# Altium schematic sheet USB_SD.SchDoc
size Tabloid; DrawnBy: V-P.Rheaume@USherbrooke.ca; Organization: Universite de Sherbrooke; Address1: L3, 12a Rodborough Rd; Address2: Frenchs Forest; Address3: NSW; Address4: Australia 2086; Revision: 0; SheetNumber: 4; SheetTotal: 8; SheetName: USB hub
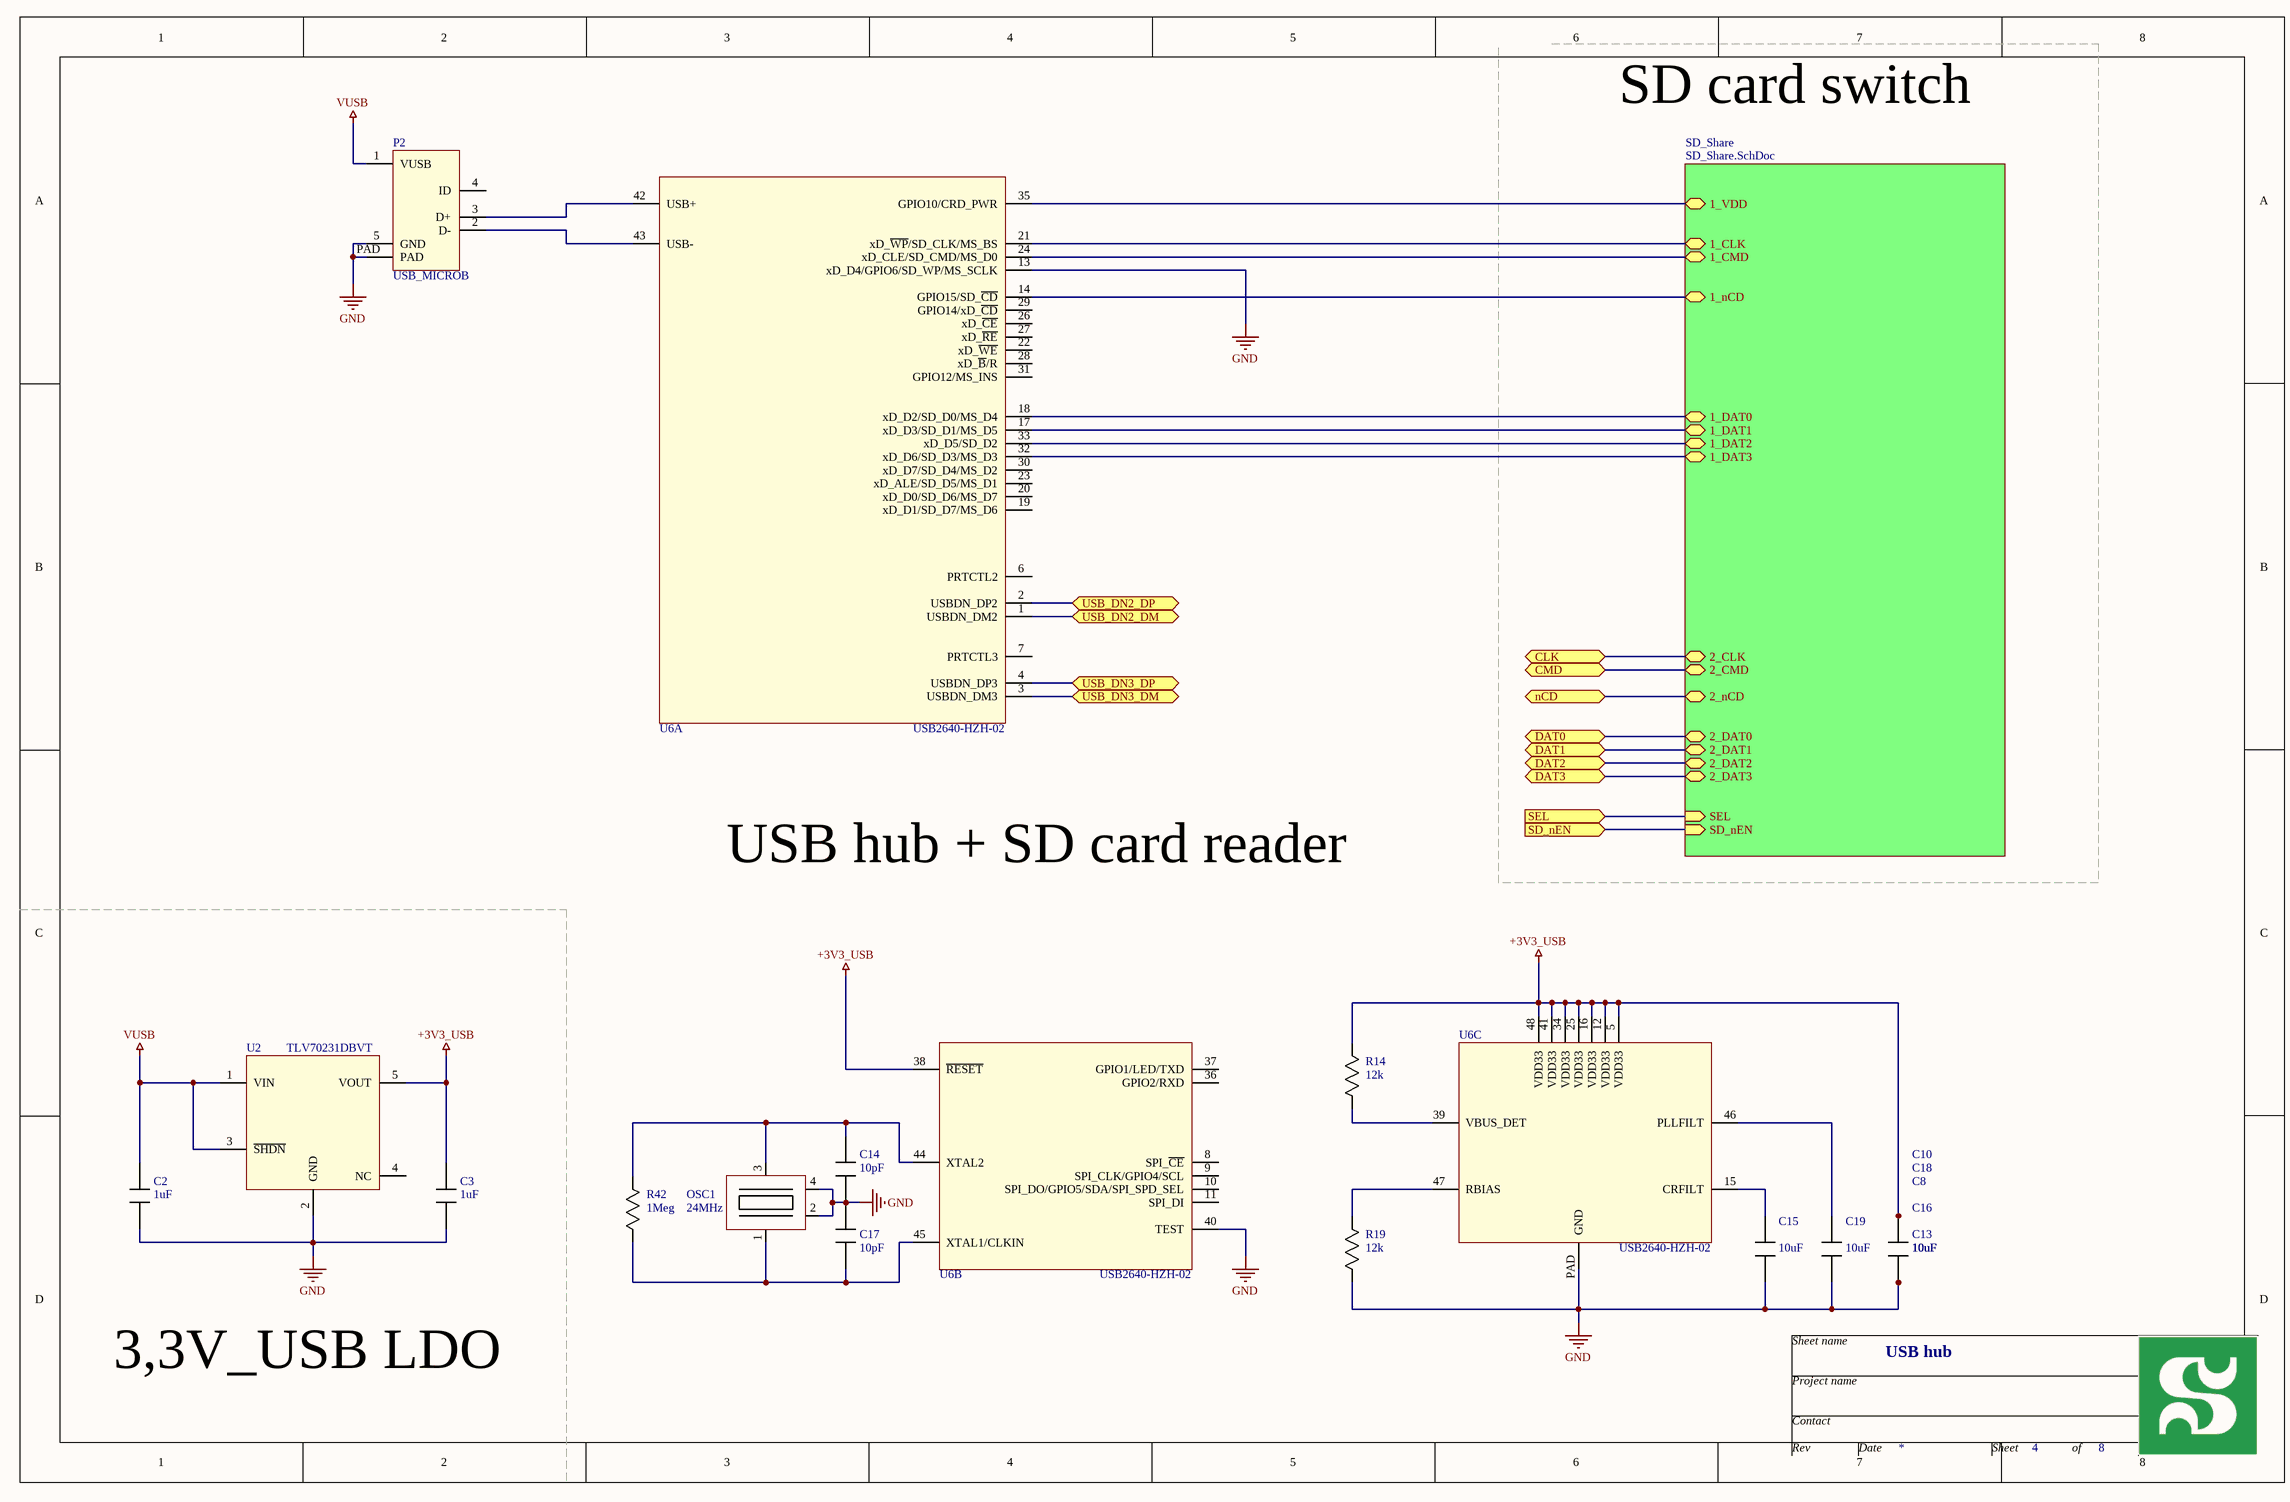
[diagram p0: USB_SD.SchDoc]

## Parts
C2  value 1uF  [0603]  (hidden comment: Capacitor)
C3  value 1uF  [0603]  (hidden comment: Capacitor)
C8  value 10uF  [0603]  (hidden comment: Capacitor)
C10  value 10uF  [0603]  (hidden comment: Capacitor)
C13  value 10uF  [0603]  (hidden comment: Capacitor)
C14  value 10pF  [0402]  (hidden comment: Capacitor)
C15  value 10uF  [0603]  (hidden comment: Capacitor)
C16  value 10uF  [0603]  (hidden comment: Capacitor)
C17  value 10pF  [0402]  (hidden comment: Capacitor)
C18  value 10uF  [0603]  (hidden comment: Capacitor)
C19  value 10uF  [0603]  (hidden comment: Capacitor)
OSC1  value 24MHz  [XTAL_ABM10]  (hidden comment: Crystal_4)
P2  USB_MICROB  [USB_MICROB]
R14  value 12k  [0402]  (hidden comment: Resistor)
R19  value 12k  [0402]  (hidden comment: Resistor)
R42  value 1Meg  [0603]  (hidden comment: Resistor)
U2  Mfg_PN: TLV70231DBVT  [SOT23_5]  (hidden comment: AP2112K-3.3TRG1)
U6  USB2640-HZH-02  [QFN48]  (parts A,B,C of 3)

## Sub-sheets
SD_Share = SD_Share.SchDoc: 2_DAT0 (bidir), 2_DAT1 (bidir), 1_nCD (bidir), 1_VDD (bidir), 2_nCD (bidir), SEL (in), 2_DAT3 (bidir), 1_DAT2 (bidir), 1_DAT1 (bidir), 1_CLK (bidir), 1_CMD (bidir), 2_CMD (bidir), 2_DAT2 (bidir), 1_DAT0 (bidir), 2_CLK (bidir), 1_DAT3 (bidir), SD_nEN (in)

## Ports
CLK (bidir), CMD (bidir), DAT0 (bidir), DAT1 (bidir), DAT2 (bidir), DAT3 (bidir), nCD (bidir), SD_nEN (in), SEL (in), USB_DN2_DM (bidir), USB_DN2_DP (bidir), USB_DN3_DM (bidir), USB_DN3_DP (bidir)

## Nets
+3V3_USB: C3.1 C8.1 C10.1 C13.1 C16.1 C18.1 R14.1 U2.5(VOUT) U6.5(VDD33) U6.12(VDD33) U6.16(VDD33) U6.25(VDD33) U6.34(VDD33) U6.38(~{RESET}) U6.41(VDD33) U6.48(VDD33)
GND: C2.2 C3.2 C8.2 C10.2 C13.2 C14.2 C15.2 C16.2 C17.1 C18.2 C19.2 OSC1.2 OSC1.4 P2.5(GND) P2.PAD R19.2 U2.2(GND) U6.13(xD_D4/GPIO6/SD_WP/MS_SCLK) U6.40(TEST) U6.PAD(GND)
VUSB: C2.1 P2.1(VUSB) U2.1(VIN) U2.3(~{SHDN})
CLK: port CLK, sheet SD_Share/2_CLK
CMD: port CMD, sheet SD_Share/2_CMD
DAT0: port DAT0, sheet SD_Share/2_DAT0
DAT1: port DAT1, sheet SD_Share/2_DAT1
DAT2: port DAT2, sheet SD_Share/2_DAT2
DAT3: port DAT3, sheet SD_Share/2_DAT3
nCD: port nCD, sheet SD_Share/2_nCD
SD_nEN: port SD_nEN, sheet SD_Share/SD_nEN
SEL: port SEL, sheet SD_Share/SEL
USB_DN2_DM: U6.1(USBDN_DM2) ; port USB_DN2_DM
USB_DN2_DP: U6.2(USBDN_DP2) ; port USB_DN2_DP
USB_DN3_DM: U6.3(USBDN_DM3) ; port USB_DN3_DM
USB_DN3_DP: U6.4(USBDN_DP3) ; port USB_DN3_DP
NetC14_1: C14.1 OSC1.3 R42.1 U6.44(XTAL2)
NetC15_1: C15.1 U6.15(CRFILT)
NetC17_2: C17.2 OSC1.1 R42.2 U6.45(XTAL1/CLKIN)
NetC19_1: C19.1 U6.46(PLLFILT)
NetP2_2: P2.2(D-) U6.43(USB-)
NetP2_3: P2.3(D+) U6.42(USB+)
NetR14_2: R14.2 U6.39(VBUS_DET)
NetR19_1: R19.1 U6.47(RBIAS)
NetU6_14: U6.14(GPIO15/SD_~{CD}) ; sheet SD_Share/1_nCD
NetU6_17: U6.17(xD_D3/SD_D1/MS_D5) ; sheet SD_Share/1_DAT1
NetU6_18: U6.18(xD_D2/SD_D0/MS_D4) ; sheet SD_Share/1_DAT0
NetU6_21: U6.21(xD_~{WP}/SD_CLK/MS_BS) ; sheet SD_Share/1_CLK
NetU6_24: U6.24(xD_CLE/SD_CMD/MS_D0) ; sheet SD_Share/1_CMD
NetU6_32: U6.32(xD_D6/SD_D3/MS_D3) ; sheet SD_Share/1_DAT3
NetU6_33: U6.33(xD_D5/SD_D2) ; sheet SD_Share/1_DAT2
NetU6_35: U6.35(GPIO10/CRD_PWR) ; sheet SD_Share/1_VDD

Not connected (* = marked no-connect by the designer): P2 4(ID); U2 4(NC); U6 6(PRTCTL2) 7(PRTCTL3) 8(SPI_~{CE}) 9(SPI_CLK/GPIO4/SCL) 10(SPI_DO/GPIO5/SDA/SPI_SPD_SEL) 11(SPI_DI) 19(xD_D1/SD_D7/MS_D6) 20(xD_D0/SD_D6/MS_D7) 22(xD_~{WE}) 23(xD_ALE/SD_D5/MS_D1) 26(xD_~{CE}) 27(xD_~{RE}) 28(xD_~{B}/R) 29(GPIO14/xD_~{CD}) 30(xD_D7/SD_D4/MS_D2) 31(GPIO12/MS_INS) 36(GPIO2/RXD) 37(GPIO1/LED/TXD)

## Notes on the sheet
- SD card switch
- USB hub + SD card reader
- 3,3V_USB LDO
- Sheet name
- Project name
- Contact
- Rev
- Date
- Sheet
- of

## Library data of the parts
C2 C3 = Capacitor: Mfg: Samsung; Mfg_PN: CL10A105KP8NNNC; HelpURL: *; NI: *; Supplier1: Digikey; Supplier1_PN: 1276-1182-1-ND; Tolerance: *; Type: *; Rating: *
C8 C10 C13 C15 C16 C18 C19 = Capacitor: Mfg: Murata; Mfg_PN: GRM188R60J106ME47D; HelpURL: *; NI: *; Supplier1: Digikey; Supplier1_PN: 490-3896-1-ND; Tolerance: *; Type: *; Rating: *
C14 C17 = Capacitor: Mfg: Wurth; Mfg_PN: 885012005007; HelpURL: *; NI: *; Supplier1: Digikey; Supplier1_PN: 732-7425-1-ND; Tolerance: *; Type: *; Rating: *
OSC1 = Crystal_4: Crystal; Mfg: Abracon; Mfg_PN: ABM10-24.000MHZ-E20-T; HelpURL: *; NI: *; Rating: *; Supplier1: Digikey; Supplier1_PN: 535-9093-1-ND; Tolerance: *; Type: *
P2 = USB_MICROB: Micro-B USB connector; Mfg: Amphenol; Mfg_PN: 10118193-0001LF; HelpURL: http://portal.fciconnect.com/Comergent//fci/drawing/10118193.pdf; NI: *; Rating: *; Supplier1: Digikey; Supplier1_PN: 609-4616-1-ND; Tolerance: *; Type: *; Value: *
R14 R19 = Resistor: Mfg: Yageo; Mfg_PN: RC0402JR-0712KL; HelpURL: *; NI: *; Supplier1: Digikey; Supplier1_PN: 311-12KJRCT-ND; Type: *; Rating: *; Tolerance: *
R42 = Resistor: Mfg: Stackpole; Mfg_PN: RMCF0603JG1M00; HelpURL: *; NI: *; Supplier1: Digikey; Supplier1_PN: RMCF0603JG1M00CT-ND; Type: *; Rating: *; Tolerance: *
U2 = AP2112K-3.3TRG1: Linear voltage regulator; Mfg: TI; HelpURL: *; NI: *; Supplier1: Digikey; Supplier1_PN: 296-27894-1-ND; Type: *
U6 = USB2640-HZH-02: USB2 hub and card reader; Mfg: Microchip; HelpURL: *; NI: *; Rating: *; Supplier1: Digikey; Supplier1_PN: USB2640-HZH-02-ND; Tolerance: *; Type: *; Value: *; Mfg_PN: USB2640-HZH-02